# Altium schematic sheet Misc.SchDoc
size 420 x 297 mm; SheetNumber: 3; SheetTotal: 4
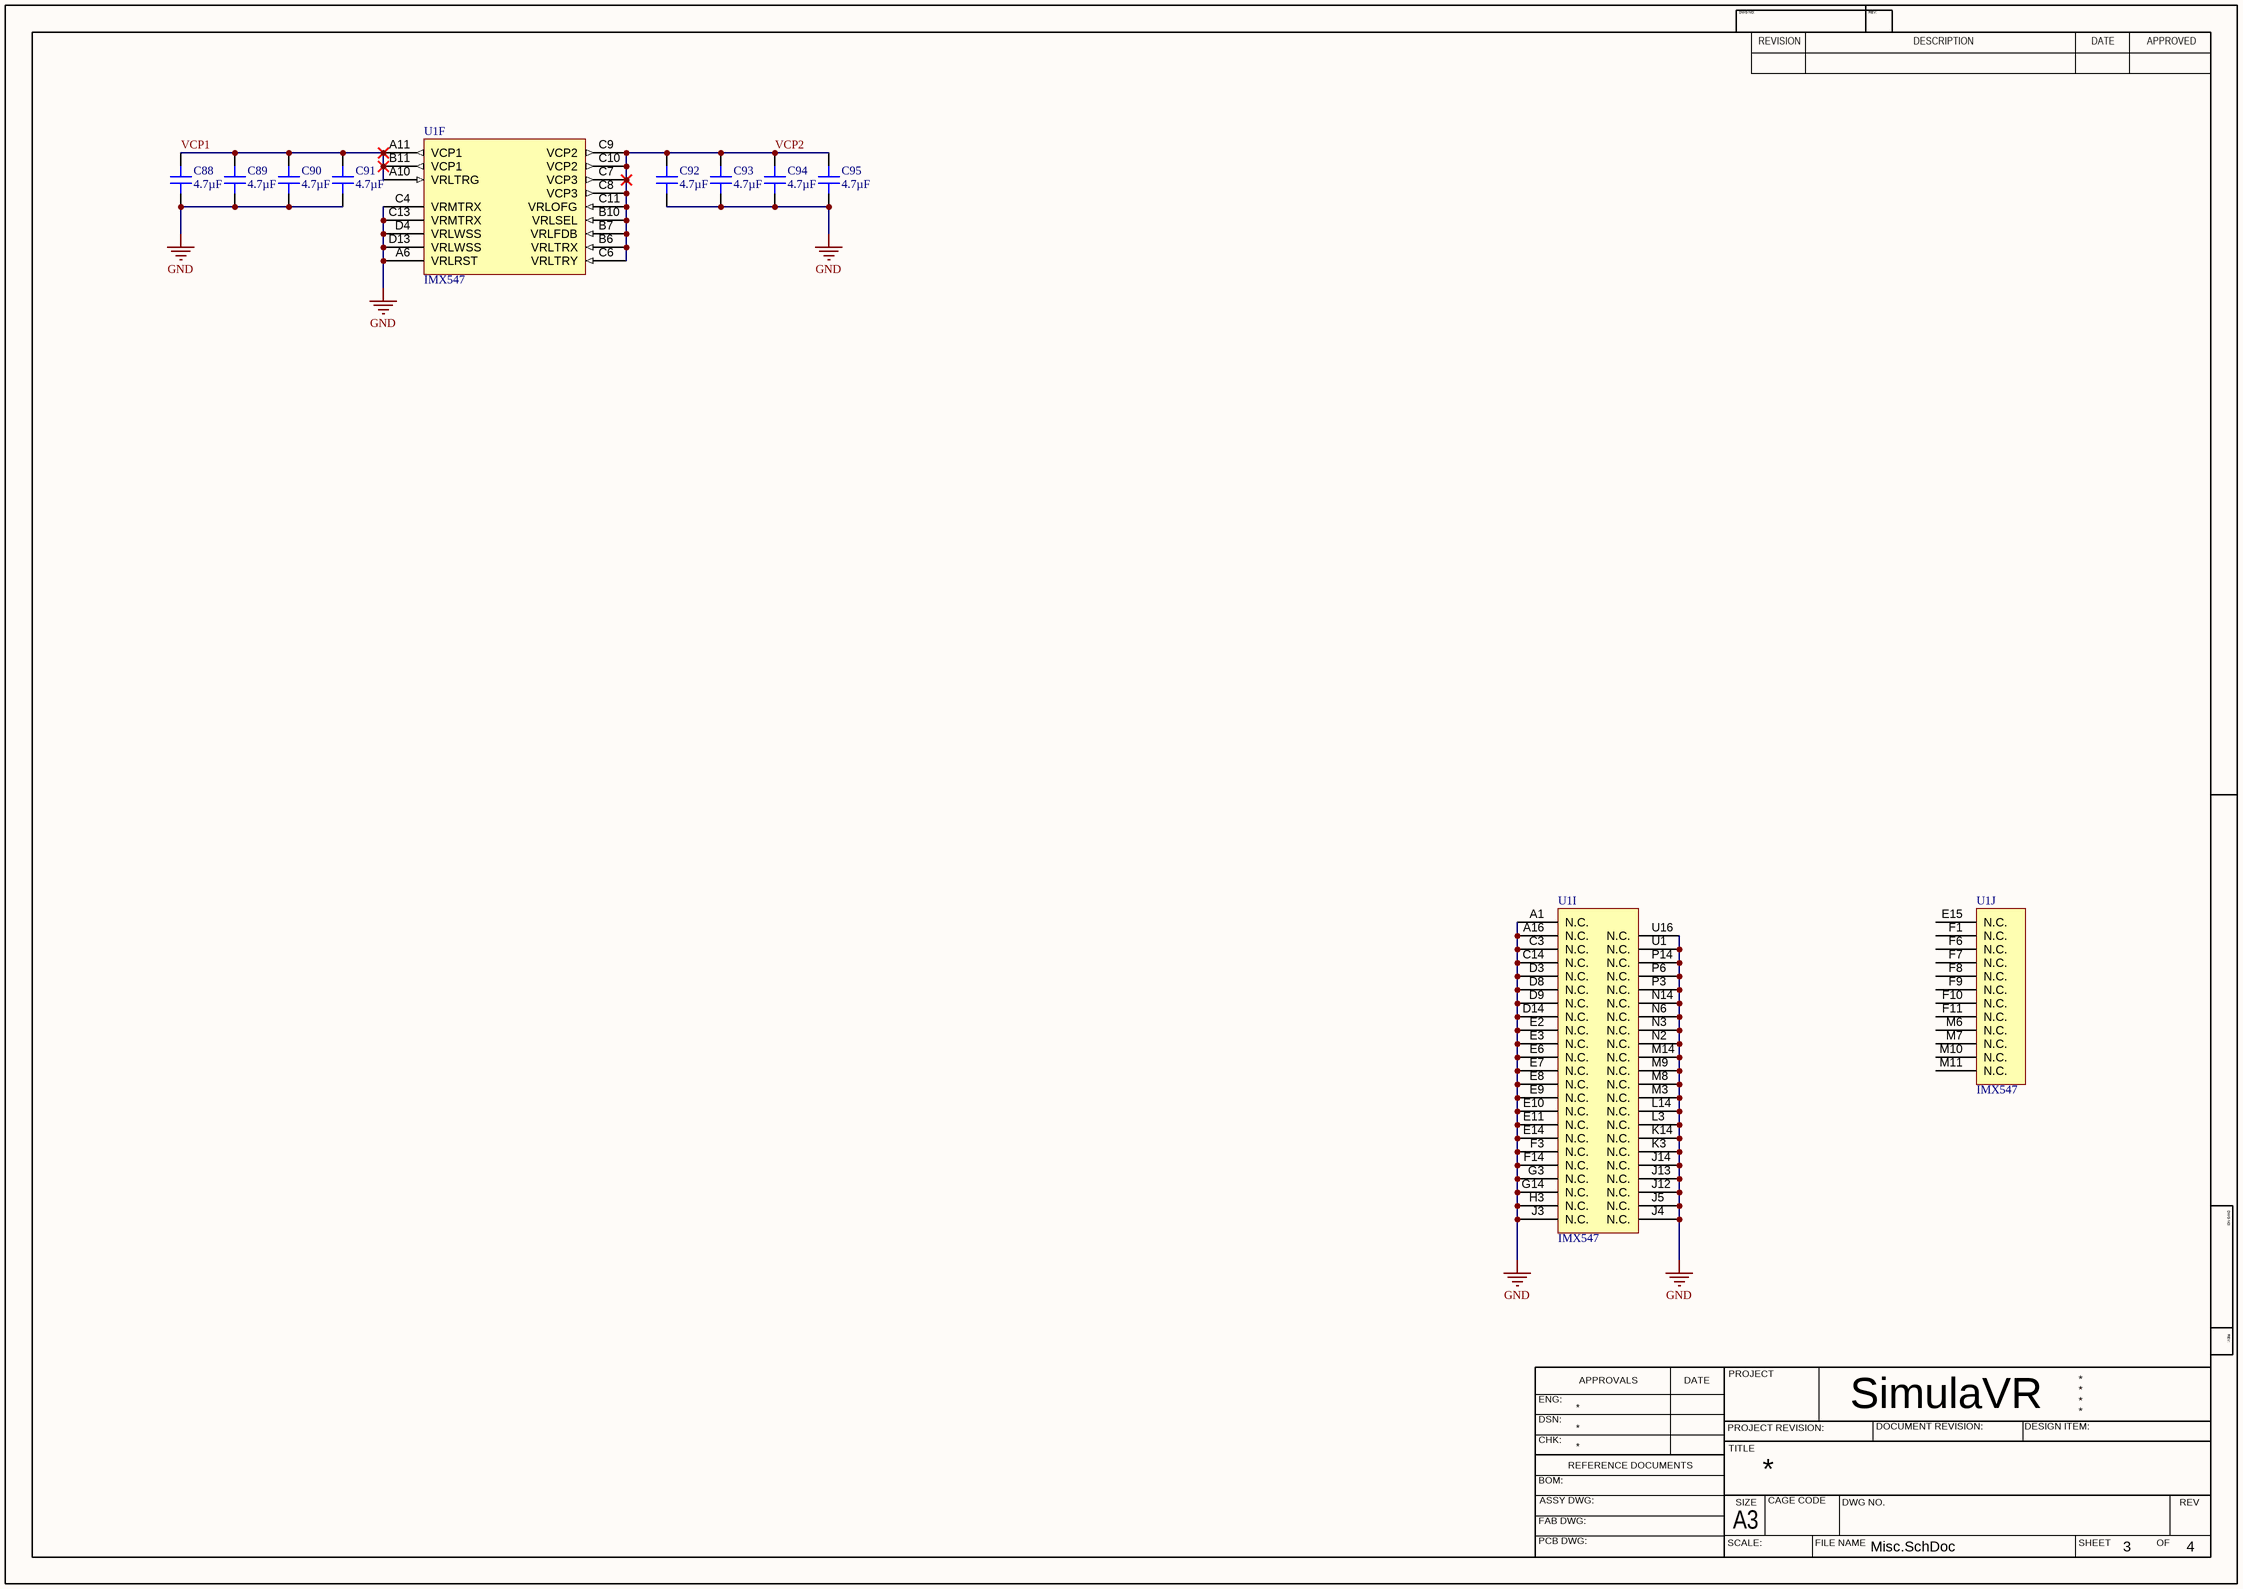
[diagram p0: Misc.SchDoc]

## Parts
C88  4.7µF  [FP-GRM155-0_15-MFG]
C89  4.7µF  [FP-GRM155-0_15-MFG]
C90  4.7µF  [FP-GRM155-0_15-MFG]
C91  4.7µF  [FP-GRM155-0_15-MFG]
C92  4.7µF  [FP-GRM155-0_15-MFG]
C93  4.7µF  [FP-GRM155-0_15-MFG]
C94  4.7µF  [FP-GRM155-0_15-MFG]
C95  4.7µF  [FP-GRM155-0_15-MFG]
U1  IMX547  [LGA230C100P16X17_1680X2000X260]  (parts F,I,J of 11)

## Nets
GND: C88.1 C89.1 C90.1 C91.1 C92.1 C93.1 C94.1 C95.1 U1.A1(N.C.) U1.A6(VRLRST) U1.A16(N.C.) U1.C3(N.C.) U1.C4(VRMTRX) U1.C13(VRMTRX) U1.C14(N.C.) U1.D3(N.C.) U1.D4(VRLWSS) U1.D8(N.C.) U1.D9(N.C.) U1.D13(VRLWSS) U1.D14(N.C.) U1.E2(N.C.) U1.E3(N.C.) U1.E6(N.C.) U1.E7(N.C.) U1.E8(N.C.) U1.E9(N.C.) U1.E10(N.C.) U1.E11(N.C.) U1.E14(N.C.) U1.F3(N.C.) U1.F14(N.C.) U1.G3(N.C.) U1.G14(N.C.) U1.H3(N.C.) U1.J3(N.C.) U1.J4(N.C.) U1.J5(N.C.) U1.J12(N.C.) U1.J13(N.C.) U1.J14(N.C.) U1.K3(N.C.) U1.K14(N.C.) U1.L3(N.C.) U1.L14(N.C.) U1.M3(N.C.) U1.M8(N.C.) U1.M9(N.C.) U1.M14(N.C.) U1.N2(N.C.) U1.N3(N.C.) U1.N6(N.C.) U1.N14(N.C.) U1.P3(N.C.) U1.P6(N.C.) U1.P14(N.C.) U1.U1(N.C.) U1.U16(N.C.)
VCP1: C88.2 C89.2 C90.2 C91.2 U1.A10(VRLTRG) U1.A11(VCP1) U1.B11(VCP1)
VCP2: C92.2 C93.2 C94.2 C95.2 U1.B6(VRLTRX) U1.B7(VRLFDB) U1.B10(VRLSEL) U1.C6(VRLTRY) U1.C7(VCP3) U1.C8(VCP3) U1.C9(VCP2) U1.C10(VCP2) U1.C11(VRLOFG)

Not connected (* = marked no-connect by the designer): U1 E15(N.C.) F1(N.C.) F6(N.C.) F7(N.C.) F8(N.C.) F9(N.C.) F10(N.C.) F11(N.C.) M6(N.C.) M7(N.C.) M10(N.C.) M11(N.C.)

## Notes on the sheet
- DWG NO:
- REVISION
- REV:
- DESCRIPTION
- DATE
- APPROVED
- ENG:
- APPROVALS
- PROJECT
- DSN:
- CHK:
- REFERENCE DOCUMENTS
- PROJECT REVISION:
- TITLE
- SimulaVR
- DOCUMENT REVISION:
- DESIGN ITEM:
- BOM:
- FAB DWG:
- PCB DWG:
- ASSY DWG:
- SCALE:
- A3
- SIZE
- CAGE CODE
- FILE NAME
- DWG NO.
- SHEET
- OF
- REV

## Library data of the parts
C88-C95 = GRM155R61A475MEAAD: CAP CER 4.7UF 10V X5R 0402; Manufacturer: Murata Electronics; Tolerance: ±20%; Part Number: GRM155R61A475MEAAD; Value: 4.7µF; Applications: General Purpose; Capacitance: 4.7µF; ComponentLink1Description: Datasheet; ComponentLink1URL: https://search.murata.co.jp/Ceramy/image/img/A01X/G101/ENG/GRM155R61A475MEAA-01.pdf; ComponentLink2Description: DigiKey Link; ComponentLink2URL: https://www.digikey.com/en/products/detail/murata-electronics/GRM155R61A475MEAAD/6234735; Device Package: 0402 (1005 Metric); LastUpdated: 2/8/2022 12:26:50 PM; Lifecycle Status: Active; Minimum Order: 1; Mounting Type: Surface Mount, MLCC; Operating Temperature: -55°C ~ 85°C; Package / Case: 0402 (1005 Metric); Packaging: TapeAndReel; PartId: 6746; Part Status: Active; Price: 0.03; Series: GRM; Size / Dimension: 0.039" L x 0.020" W (1.00mm x 0.50mm); Supplier 1: DigiKey; Supplier Part Number 1: 490-14306-1-ND; Temperature Coefficient: X5R; Thickness (Max): 0.026" (0.65mm); Voltage - Rated: 10V
U1 = CMP-001-0000-4: Sony IMX547 sensor